# EAGLE design SpaceFleaSolar (EAGLE 6.5.0)
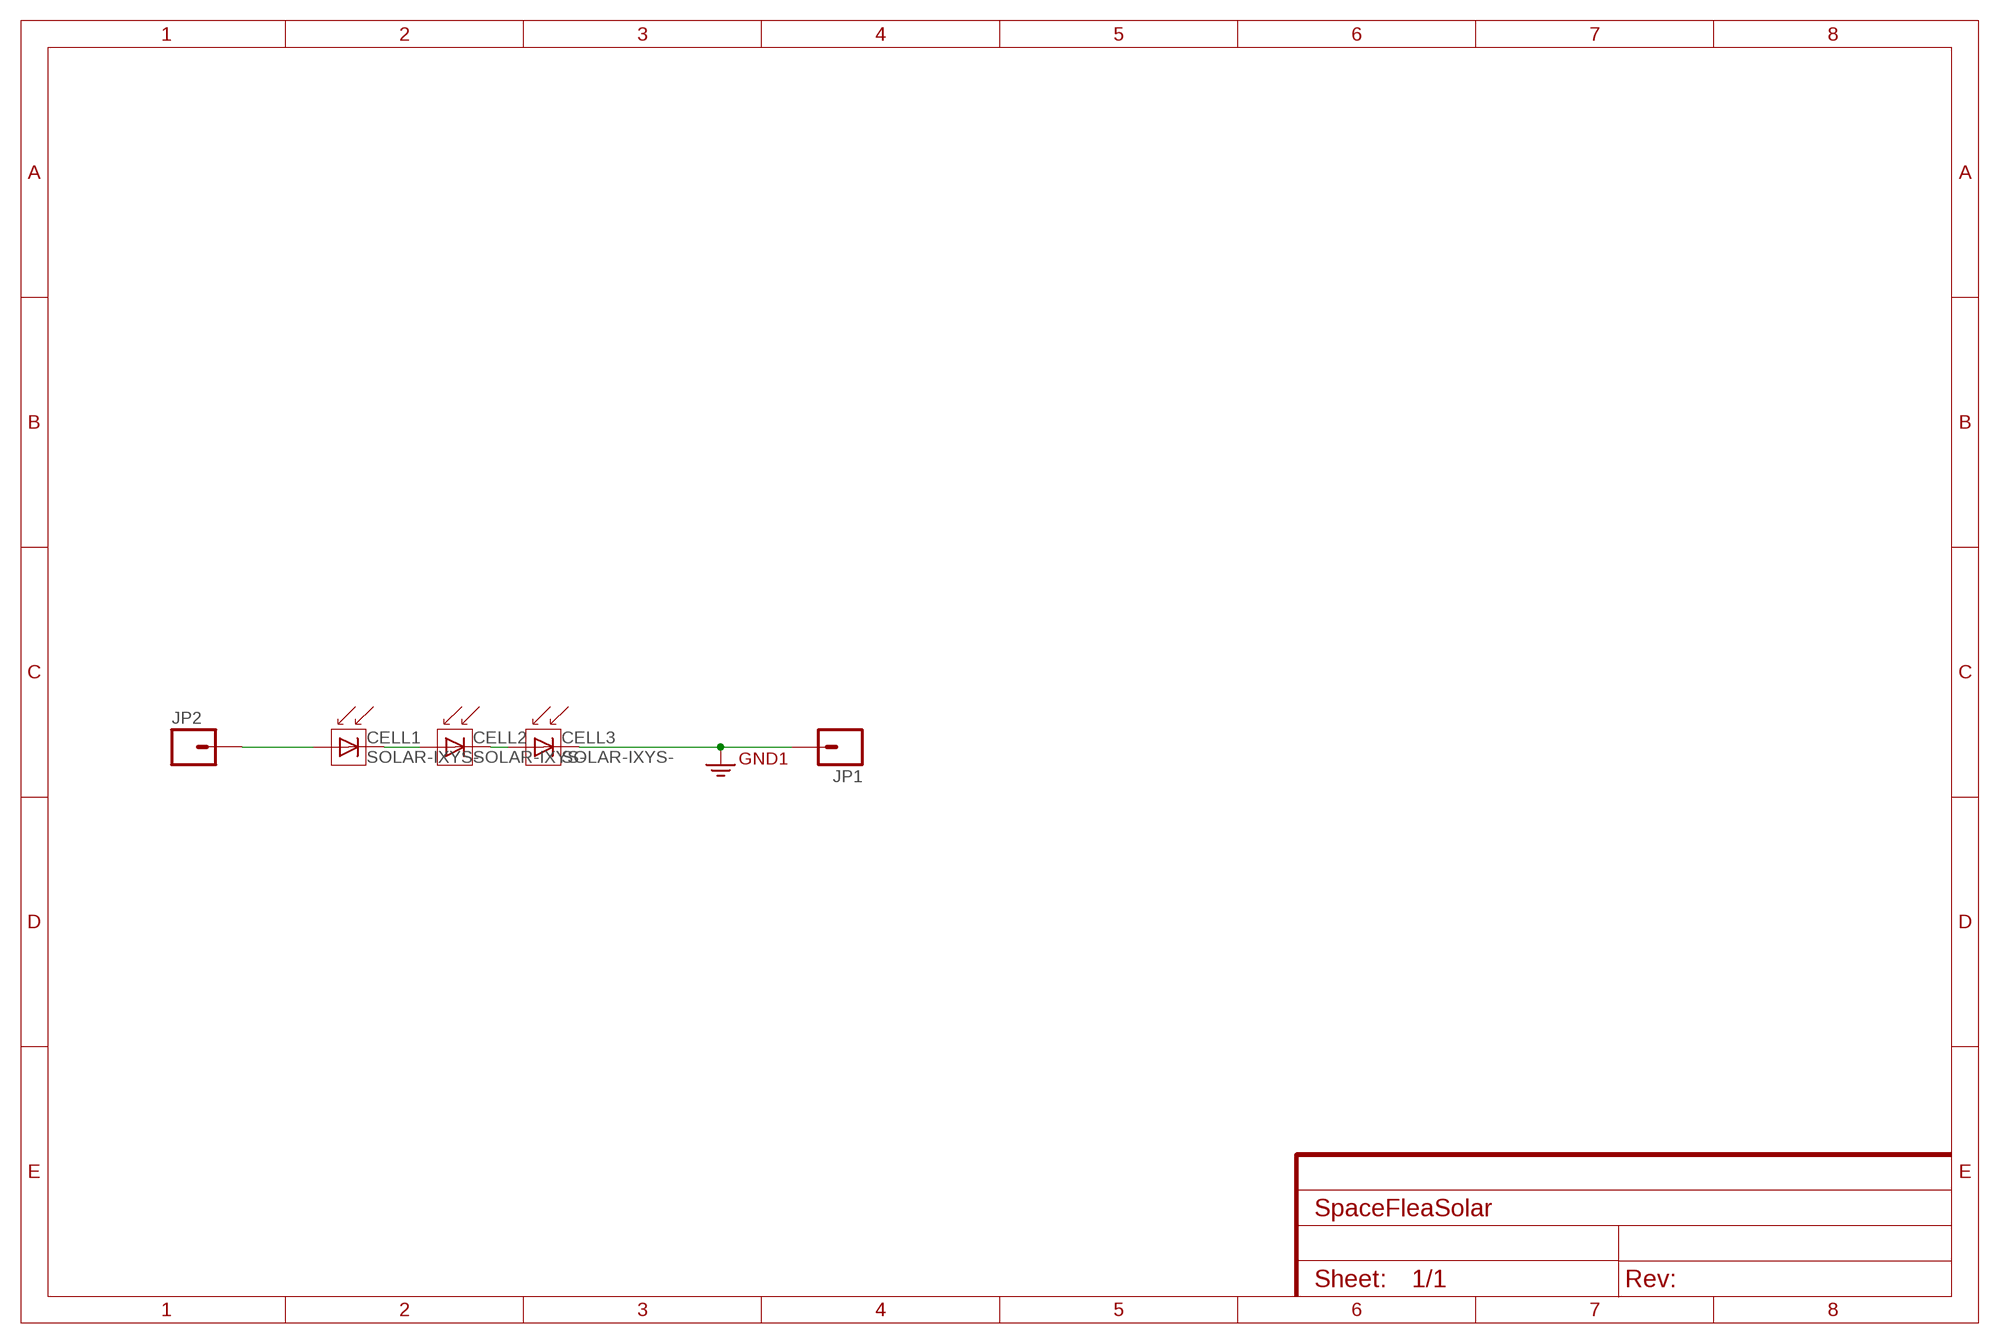
[diagram p0: schematic, sheet 1]

## Parts
CELL1  SOLAR-IXYS-  [SOLARBIT-12X1]
CELL2  SOLAR-IXYS-  [SOLARBIT-12X1]
CELL3  SOLAR-IXYS-  [SOLARBIT-12X1]
JP1  M01PTH_2MM  [1X01_2MM]
JP2  M01PTH_2MM  [1X01_2MM]

## Nets
GND: CELL3.-(C) JP1.1 ; supply symbol labelled GND2
N$3: CELL1.-(C) CELL2.+(A)
N$4: CELL2.-(C) CELL3.+(A)
PLUS: CELL1.+(A) JP2.1

## Library data of the parts
CELL1-CELL3 = PQ Library:SOLAR-IXYS
JP1 JP2 = SparkFun-Connectors:M01: Header 1 Standard 1-pin 0.1" header. Use with straight break away headers (SKU : PRT-00116), right angle break away headers (PRT-00553), swiss pins (PRT-00743), machine pins (PRT-00117), and female headers (PRT-00115). SMTSO-256-ET is a "flush mount" nut for a 4-40 screw. The older package used to be too tight, and did not allow it to sit properly thru the drill hit. The latest (0.165DIA) fits nice and snug.

## Board
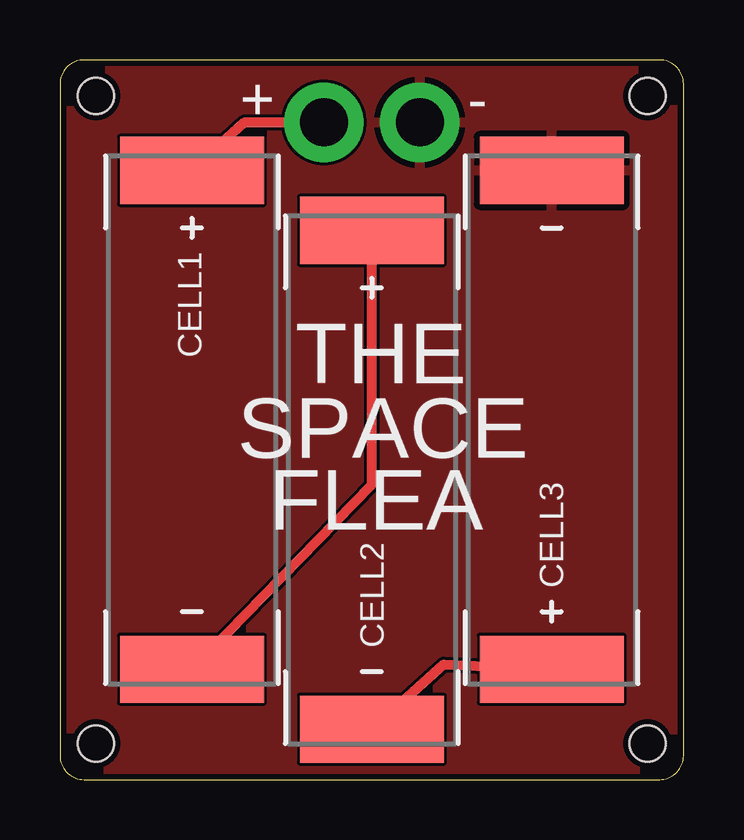
[diagram p1: board, top side]

Size 26 x 30 mm. Coordinates in mm from the lower left corner, seen from the top.
Outline: 0,29 0,1 arc90 1,0 25,0 arc90 26,1 26,29 arc90 25,30 1,30 arc90 0,29
Copper layers (1*16): Top 0.035mm / dielectric 1.5mm / Bottom 0.035mm
Design rules "dirt_cheap_dirty_boards.v1": minimum track width 5mil, minimum drill 12mil, track to track 5mil, track to pad 5mil, pad to pad 5mil, via to via 5mil, smd to smd 0mil, copper to edge 10mil, drill to drill 10mil, minimum pad ring 10mil, minimum via ring 6mil, stop-mask expansion 2mil, vias tented up to drill 25mil, thermal gap 10mil
Holes 1.5 mm at 1.5,28.5 24.5,28.5 1.5,1.5 24.5,1.5

### Footprints (pad centres in the part's own frame; a part is rotated, then mirrored left to right if it is on the bottom)
SOLARBIT-12X1 = smd 2.8 x 6: + -10.4,0; - 10.4,0
1X01_2MM = drill 2 pad 3.302: 1 0,0

### Placement (x,y rotation side)
CELL1  5.5,15 270 top
CELL2  13,12.5 270 top
CELL3  20.5,15 90 top
JP1  15,27.4 0 top
JP2  11,27.4 0 top

### Tracks (layer width: path | path; a pad name or v marks a point on that pad's centre or on a via)
GND
  pour Top: 0,29 0,1 arc90 1,0 25,0 arc90 26,1 26,29 arc90 25,30 1,30 arc90
N$3
  Top 0.406: CELL1.- 13,12.3 CELL2.+
N$4
  Top 0.406: CELL2.- 16,4.8 CELL3.+
PLUS
  Top 0.406: CELL1.+ 7.7,27.4 JP2.1

### Text on the board
tNames: + | - | THE | SPACE | FLEA